# EasyEDA Pro project 4Layer_Artix7_DDR3_Core_Board.epro, board PCB1_1
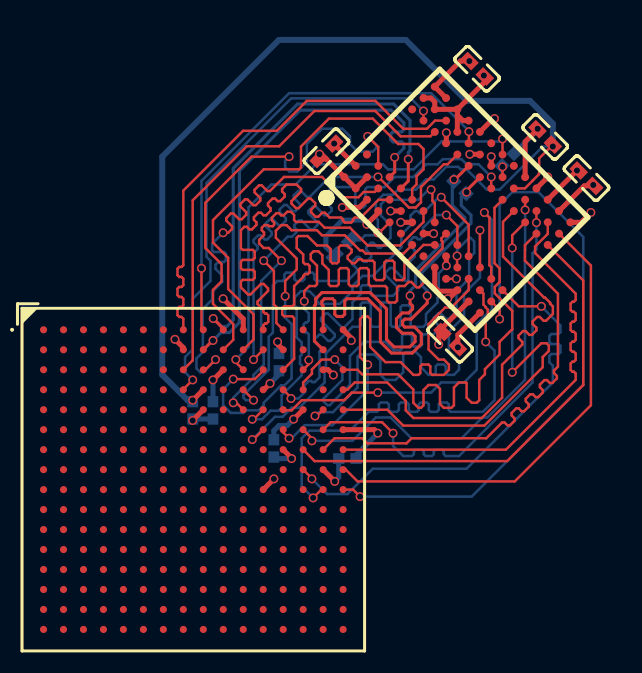
[diagram p4: board, top side]
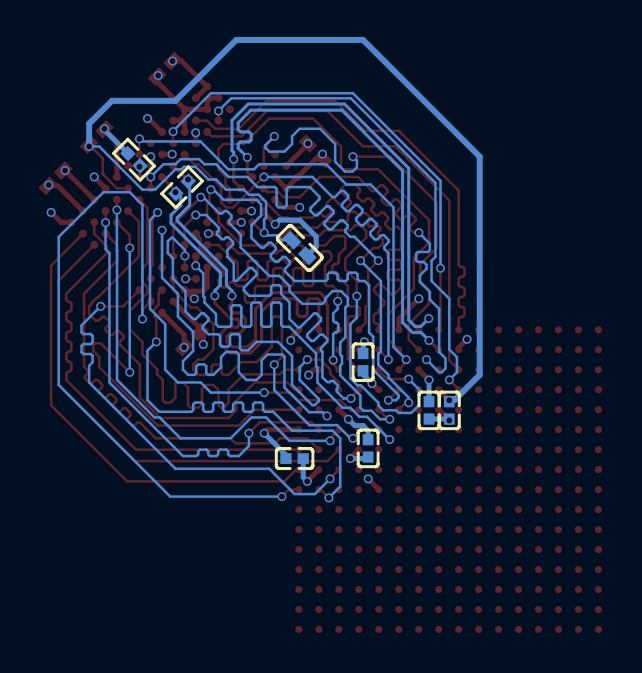
[diagram p5: board, bottom side, seen from below]

No outline. copper layers: Top Layer, Inner1, Inner2, Bottom Layer. Coordinates in mm from the lowest, leftmost part position.
Stack: Top Layer 0.035mm 外层铜厚1oz / Dielectric1 0.2104mm 7628 RC49% 8.6mil / Inner1 0.0152mm 内层铜厚 / Dielectric2 1.065mm 1.1mm H/HOZ Copper / Inner2 0.0152mm 内层铜厚 / Dielectric3 0.2104mm 7628 RC49% 8.6mil / Bottom Layer 0.035mm 外层铜厚1oz

## Design rules (mm)
net DDR_DQ2: DDR_DQ
net DDR_DQ0: DDR_DQ
net DDR_DM: DDR_DQ
net DDR_DQ3: DDR_DQ
net DDR_DQS_P: DDR_DQ, DP1
net DDR_DQ1: DDR_DQ
net DDR_DQS_N: DDR_DQ, DP1
net DDR_DQ4: DDR_DQ
net DDR_DQ5: DDR_DQ
net DDR_DQ7: DDR_DQ
net DDR_DQ6: DDR_DQ
net DDR_A8: DDR_CA
net DDR_A14: DDR_CA
net DDR_A13: DDR_CA
net DDR_A6: DDR_CA
net DDR_A11: DDR_CA
net DDR_A9: DDR_CA
net DDR_A7: DDR_CA
net DDR_A4: DDR_CA
net DDR_A1: DDR_CA
net DDR_A2: DDR_CA
net DDR_A5: DDR_CA
net DDR_BA1: DDR_CA
net DDR_A12: DDR_CA
net DDR_A0: DDR_CA
net DDR_A3: DDR_CA
net DDR_A15: DDR_CA
net DDR_BA2: DDR_CA
net DDR_BA0: DDR_CA
net DDR_A10: DDR_CA
net DDR_WE_N: DDR_CA
net DDR_CS_N: DDR_CA
net DDR_CKE: DDR_CA
net DDR_CK_N: DDR_CA, DP2
net DDR_CAS_N: DDR_CA
net DDR_ODT: DDR_CA
net DDR_CK_P: DDR_CA, DP2
net DDR_RAS_N: DDR_CA
template: 自定义配置
spacing copperThickness1oz (default): track to track 0.127, other pairs 0.127 to 0.3
spacing copperThickness2oz: track to track 0.203, other pairs 0.152 to 0.3
spacing copperThicknessInner0.5oz: track to track 0.089, other pairs 0.152 to 0.3
track width copperThickness1oz (default): min 0.102, default 0.127, max 2.54
track width copperThickness2oz: min 0.203, default 0.254, max 2.54
track width copperThickness0.5oz: min 0.089, default 0.254, max 2.54
differential pair differentialPair (default): width min 0.127, default 0.156, max 2.54; gap min 0.152, default 0.152
via viaSize (default): diameter min 0.3, default 0.45, max 10; hole min 0.2, default 0.305, max 6.3

## Placement (name value [footprint] x y rotation side)
C1  100nF  [C0402]  12.89 7.01 135 top
C3  100nF  [C0402]  14.24 20.57 135 top
C4  100nF  [C0402]  6.7 16.44 45 top
C5  100nF  [C0402]  19.72 15.09 315 top
C7  100nF  [C0402]  17.65 17.15 315 top
C8  100nF  [C0402]  7.49 11.59 45 bottom
C9  470nF  [C0402-S]  7.75 1.05 180 bottom
C10  470nF  [C0402-S]  4.06 1.56 90 bottom
C11  470nF  [C0402-S]  0 3.47 90 bottom
C12  470nF  [C0402-S]  4.32 5.88 90 bottom
C13  470nF  [C0402-S]  1.02 3.47 90 bottom
R1  240  [R0402]  15.79 16.02 225 bottom
R2  100  [R0402]  13.38 14.63 315 bottom
U1  XC7A35T-2FTG256I  [FTBGA-256_L17.0-W17.0-R16-C16-P1.00-TL]  0.03 0 0 top
U2  MT41K512M8DA-107 AIT:P  [FBGA-78_L10.5-W8.0-R13-C6-P0.80-TL]  13.25 14.01 45 top

## Footprints (pads in the part's own frame, mm; a bottom-side part is the same pattern mirrored in y, then rotated)
C0402
  rect 0.79x0.54 smd: 1(-0.545,0) 2(0.545,0)
C0402-S
  rect 0.566x0.54 smd: 1(-0.433,0) 2(0.433,0)
FBGA-78_L10.5-W8.0-R13-C6-P0.80-TL
  round 0.4 smd: A1(-3.2,4.8) A2(-2.4,4.8) A3(-1.6,4.8) A7(1.6,4.8) A8(2.4,4.8) A9(3.2,4.8) B1(-3.2,4) B2(-2.4,4) B3(-1.6,4) B7(1.6,4) B8(2.4,4) B9(3.2,4) C1(-3.2,3.2) C2(-2.4,3.2) C3(-1.6,3.2) C7(1.6,3.2) C8(2.4,3.2) C9(3.2,3.2) D1(-3.2,2.4) D2(-2.4,2.4) D3(-1.6,2.4) D7(1.6,2.4) D8(2.4,2.4) D9(3.2,2.4) E1(-3.2,1.6) E2(-2.4,1.6) E3(-1.6,1.6) E7(1.6,1.6) E8(2.4,1.6) E9(3.2,1.6) F1(-3.2,0.8) F2(-2.4,0.8) F3(-1.6,0.8) F7(1.6,0.8) F8(2.4,0.8) F9(3.2,0.8) G1(-3.2,0) G2(-2.4,0) G3(-1.6,0) G7(1.6,0) G8(2.4,0) G9(3.2,0) H1(-3.2,-0.8) H2(-2.4,-0.8) H3(-1.6,-0.8) H7(1.6,-0.8) H8(2.4,-0.8) H9(3.2,-0.8) J1(-3.2,-1.6) J2(-2.4,-1.6) J3(-1.6,-1.6) J7(1.6,-1.6) J8(2.4,-1.6) J9(3.2,-1.6) K1(-3.2,-2.4) K2(-2.4,-2.4) K3(-1.6,-2.4) K7(1.6,-2.4) K8(2.4,-2.4) K9(3.2,-2.4) L1(-3.2,-3.2) L2(-2.4,-3.2) L3(-1.6,-3.2) L7(1.6,-3.2) L8(2.4,-3.2) L9(3.2,-3.2) M1(-3.2,-4) M2(-2.4,-4) M3(-1.6,-4) M7(1.6,-4) M8(2.4,-4) M9(3.2,-4) N1(-3.2,-4.8) N2(-2.4,-4.8) N3(-1.6,-4.8) N7(1.6,-4.8) N8(2.4,-4.8) N9(3.2,-4.8)
FTBGA-256_L17.0-W17.0-R16-C16-P1.00-TL
  round 0.36 smd: A1(-7.5,7.5) A2(-6.5,7.5) A3(-5.5,7.5) A4(-4.5,7.5) A5(-3.5,7.5) A6(-2.5,7.5) A7(-1.5,7.5) A8(-0.5,7.5) A9(0.5,7.5) A10(1.5,7.5) A11(2.5,7.5) A12(3.5,7.5) A13(4.5,7.5) A14(5.5,7.5) A15(6.5,7.5) A16(7.5,7.5) B1(-7.5,6.5) B2(-6.5,6.5) B3(-5.5,6.5) B4(-4.5,6.5) B5(-3.5,6.5) B6(-2.5,6.5) B7(-1.5,6.5) B8(-0.5,6.5) B9(0.5,6.5) B10(1.5,6.5) B11(2.5,6.5) B12(3.5,6.5) B13(4.5,6.5) B14(5.5,6.5) B15(6.5,6.5) B16(7.5,6.5) C1(-7.5,5.5) C2(-6.5,5.5) C3(-5.5,5.5) C4(-4.5,5.5) C5(-3.5,5.5) C6(-2.5,5.5) C7(-1.5,5.5) C8(-0.5,5.5) C9(0.5,5.5) C10(1.5,5.5) C11(2.5,5.5) C12(3.5,5.5) C13(4.5,5.5) C14(5.5,5.5) C15(6.5,5.5) C16(7.5,5.5) D1(-7.5,4.5) D2(-6.5,4.5) D3(-5.5,4.5) D4(-4.5,4.5) D5(-3.5,4.5) D6(-2.5,4.5) D7(-1.5,4.5) D8(-0.5,4.5) D9(0.5,4.5) D10(1.5,4.5) D11(2.5,4.5) D12(3.5,4.5) D13(4.5,4.5) D14(5.5,4.5) D15(6.5,4.5) D16(7.5,4.5) E1(-7.5,3.5) E2(-6.5,3.5) E3(-5.5,3.5) E4(-4.5,3.5) E5(-3.5,3.5) E6(-2.5,3.5) E7(-1.5,3.5) E8(-0.5,3.5) E9(0.5,3.5) E10(1.5,3.5) E11(2.5,3.5) E12(3.5,3.5) E13(4.5,3.5) E14(5.5,3.5) E15(6.5,3.5) E16(7.5,3.5) F1(-7.5,2.5) F2(-6.5,2.5) F3(-5.5,2.5) F4(-4.5,2.5) F5(-3.5,2.5) F6(-2.5,2.5) F7(-1.5,2.5) F8(-0.5,2.5) F9(0.5,2.5) F10(1.5,2.5) F11(2.5,2.5) F12(3.5,2.5) F13(4.5,2.5) F14(5.5,2.5) F15(6.5,2.5) F16(7.5,2.5) G1(-7.5,1.5) G2(-6.5,1.5) G3(-5.5,1.5) G4(-4.5,1.5) G5(-3.5,1.5) G6(-2.5,1.5) G7(-1.5,1.5) G8(-0.5,1.5) G9(0.5,1.5) G10(1.5,1.5) G11(2.5,1.5) G12(3.5,1.5) G13(4.5,1.5) G14(5.5,1.5) G15(6.5,1.5) G16(7.5,1.5) H1(-7.5,0.5) H2(-6.5,0.5) H3(-5.5,0.5) H4(-4.5,0.5) H5(-3.5,0.5) H6(-2.5,0.5) H7(-1.5,0.5) H8(-0.5,0.5) H9(0.5,0.5) H10(1.5,0.5) H11(2.5,0.5) H12(3.5,0.5) H13(4.5,0.5) H14(5.5,0.5) H15(6.5,0.5) H16(7.5,0.5) J1(-7.5,-0.5) J2(-6.5,-0.5) J3(-5.5,-0.5) J4(-4.5,-0.5) J5(-3.5,-0.5) J6(-2.5,-0.5) J7(-1.5,-0.5) J8(-0.5,-0.5) J9(0.5,-0.5) J10(1.5,-0.5) J11(2.5,-0.5) J12(3.5,-0.5) J13(4.5,-0.5) J14(5.5,-0.5) J15(6.5,-0.5) J16(7.5,-0.5) K1(-7.5,-1.5) K2(-6.5,-1.5) K3(-5.5,-1.5) K4(-4.5,-1.5) K5(-3.5,-1.5) K6(-2.5,-1.5) K7(-1.5,-1.5) K8(-0.5,-1.5) K9(0.5,-1.5) K10(1.5,-1.5) K11(2.5,-1.5) K12(3.5,-1.5) K13(4.5,-1.5) K14(5.5,-1.5) K15(6.5,-1.5) K16(7.5,-1.5) L1(-7.5,-2.5) L2(-6.5,-2.5) L3(-5.5,-2.5) L4(-4.5,-2.5) L5(-3.5,-2.5) L6(-2.5,-2.5) L7(-1.5,-2.5) L8(-0.5,-2.5) L9(0.5,-2.5) L10(1.5,-2.5) L11(2.5,-2.5) L12(3.5,-2.5) L13(4.5,-2.5) L14(5.5,-2.5) L15(6.5,-2.5) L16(7.5,-2.5) M1(-7.5,-3.5) M2(-6.5,-3.5) M3(-5.5,-3.5) M4(-4.5,-3.5) M5(-3.5,-3.5) M6(-2.5,-3.5) M7(-1.5,-3.5) M8(-0.5,-3.5) M9(0.5,-3.5) M10(1.5,-3.5) M11(2.5,-3.5) M12(3.5,-3.5) M13(4.5,-3.5) M14(5.5,-3.5) M15(6.5,-3.5) M16(7.5,-3.5) N1(-7.5,-4.5) N2(-6.5,-4.5) N3(-5.5,-4.5) N4(-4.5,-4.5) N5(-3.5,-4.5) N6(-2.5,-4.5) N7(-1.5,-4.5) N8(-0.5,-4.5) N9(0.5,-4.5) N10(1.5,-4.5) N11(2.5,-4.5) N12(3.5,-4.5) N13(4.5,-4.5) N14(5.5,-4.5) N15(6.5,-4.5) N16(7.5,-4.5) P1(-7.5,-5.5) P2(-6.5,-5.5) P3(-5.5,-5.5) P4(-4.5,-5.5) P5(-3.5,-5.5) P6(-2.5,-5.5) P7(-1.5,-5.5) P8(-0.5,-5.5) P9(0.5,-5.5) P10(1.5,-5.5) P11(2.5,-5.5) P12(3.5,-5.5) P13(4.5,-5.5) P14(5.5,-5.5) P15(6.5,-5.5) P16(7.5,-5.5) R1(-7.5,-6.5) R2(-6.5,-6.5) R3(-5.5,-6.5) R4(-4.5,-6.5) R5(-3.5,-6.5) R6(-2.5,-6.5) R7(-1.5,-6.5) R8(-0.5,-6.5) R9(0.5,-6.5) R10(1.5,-6.5) R11(2.5,-6.5) R12(3.5,-6.5) R13(4.5,-6.5) R14(5.5,-6.5) R15(6.5,-6.5) R16(7.5,-6.5) T1(-7.5,-7.5) T2(-6.5,-7.5) T3(-5.5,-7.5) T4(-4.5,-7.5) T5(-3.5,-7.5) T6(-2.5,-7.5) T7(-1.5,-7.5) T8(-0.5,-7.5) T9(0.5,-7.5) T10(1.5,-7.5) T11(2.5,-7.5) T12(3.5,-7.5) T13(4.5,-7.5) T14(5.5,-7.5) T15(6.5,-7.5) T16(7.5,-7.5)
R0402
  rect 0.566x0.54 smd: 1(-0.433,0) 2(0.433,0)

## Nets
As in the schematic.

Pads without a net: U1 A2 A3 A4 A5 A6 A7 A14 B1 B2 B3 B4 B5 B6 B7 B14 B16 C1 C2 C3 C4 C6 C7 D1 D3 D4 D5 D6 D7 D10 D15 E1 E2 E3 E4 E5 E6 E7 E8 E10 F1 F2 F3 F4 F5 F7 F8 F9 F11 G1 G2 G4 G5 G6 G7 G8 G10 G11 G12 H1 H2 H3 H4 H5 H7 H8 H9 H10 H11 H12 H13 J1 J2 J3 J4 J5 J6 J7 J8 J10 J13 J14 K1 K2 K3 K5 K7 K8 K9 K10 K11 K12 K13 K15 K16 L2 L3 L4 L5 L6 L7 L8 L9 L10 L12 L13 L14 L15 L16 M1 M2 M3 M4 M5 M6 M7 M9 M10 M11 M12 M13 M14 M15 M16 N1 N2 N3 N4 N6 N7 N8 N9 N10 N11 N12 N13 N14 N16 P1 P3 P4 P5 P6 P7 P8 P9 P10 P11 P13 P14 P15 P16 R1 R2 R3 R4 R5 R6 R7 R8 R10 R11 R12 R13 R14 R15 R16 T1 T2 T3 T4 T5 T7 T8 T9 T10 T11 T12 T13 T14 T15; U2 A3 A7 F1 F9 H1 H9

## Via types
v1: diameter 0.45, hole 0.305, Top Layer to Bottom Layer, 95 vias

## Routing (per net, layer and track width the routed paths; a pad name or vN(x,y) marks a point on that pad's centre or on a via; arc(x,y) is an arc through that point)
+1V5: length 24.5
  Top Layer w0.127: U2.K1 v1(13.21,10.05)
  Top Layer w0.254: U1.C10 1.02,4.99 v1(1.02,4.99) ; U1.J12 4.06,0.03 v1(4.06,0.04) ; v1(13.85,20.95) 13.41,20.95 12.12,19.67 12.69,19.1 ; U1.B13 4.25,6.78 v1(4.25,6.9) ; 12.51,7.61 13.82,8.92 ; 12.51,7.61 12.51,7.39 ; 12.51,7.61 12.32,7.42 v1(12.32,6.77) ; U2.G8 v1(14.95,16.17) ; U2.E2 v1(9.91,13.45) ; v1(12.7,17.36) 12.7,16.85 U2.D7 ; v1(7.08,16.82) 7.08,16.79 U2.A2 ; v1(15.11,18.07) 15.05,18.07 U2.E9 ; U1.E14 5.06,3.02 v1(5.05,3.02) ; v1(7.94,6.96) 7.94,7.09 U1.A16 ; U2.K9 17.78,15.14 v1(17.78,15.15) ; U1.H15 7.11,-0.08 v1(7.11,-0.09) ; U2.G2 v1(12.06,12.31) ; U2.M9 19.6,14.7 C5.2 ; v1(7.49,13.63) 8.34,13.63 U2.C1
  Bottom Layer w0.254: v1(7.11,-0.09) 7.31,0.11 C9.2 ; 4.3,6.25 4.3,6.78 4.23,6.85 ; C10.2 4.06,2.45 4.32,2.7 4.73,2.7 v1(5.05,3.02) ; v1(1.02,4.99) C13.2
  vias: v1(20.06,14.75)
GND: length 39.7
  Top Layer w0.254: U1.C15 6.78,5.5 v1(7.04,5.24) ; C3.1 14.63,19.91 U2.C9 ; 13.25,18.25 U2.D8 ; 13.25,18.25 13.53,17.97 U2.D9 ; 13.25,18.25 U2.C9 ; U1.A11 2.53,8.05 v1(1.52,9.06) ; U1.D12 3.56,4.5 v1(3.87,4.81) ; U1.G13 4.95,1.08 v1(4.95,1.05) ; 13.2,9.44 12.82,9.06 v1(12.77,9.06) ; 13.2,9.44 12.32,9.44 12.12,9.63 U2.J1 ; 13.2,9.44 U2.L1 ; U1.B8 -0.47,6.6 v1(-0.89,7.02) ; U2.N1 13.28,7.25 v1(13.28,6.62) ; v1(19.94,13.37) 19.45,12.88 18.91,12.88 ; U2.F8 14.37,16.29 v1(13.88,16.29) ; v1(0,2.96) 0,2.97 U1.E9 ; U2.C9 U2.B8 12.12,18.9 11.92,19.1 U2.A8 ; 9.29,13.45 9.29,13.36 v1(8.72,12.78) ; U2.L9 v1(19.24,15.47) 19.33,15.47 ; v1(9.27,2.32) 9.09,2.5 U1.F16 ; 6.69,16.05 6.44,16.29 v1(6.35,16.29) ; 6.69,16.05 C4.1 ; 6.69,16.05 U2.A1 U2.B1 U2.B2 ; C7.1 16.65,16.92 U2.J9 ; 10.99,12.88 v1(10.41,12.88)
  Bottom Layer w0.254: v1(8.72,12.78) 8.51,12.99 7.49,12.99 6.67,12.17 6.67,11.65 C8.1 ; R1.1 17.27,17.5 v1(17.27,17.56) ; C13.1 0.07,3.03 v1(0,2.96) ; v1(4.95,1.05) 4.14,1.05 C10.1 ; C12.1 4.32,5.26 v1(3.87,4.81) ; v1(9.27,2.32) 8.18,1.23 C9.1
  vias: v1(14.58,20.23)
DDR_A0: length 23.2
  Top Layer w0.127: v1(12.45,14.14) 13.82,12.76 U2.K3 ; U1.E12 3.06,3.02 v1(2.98,3.02)
  Bottom Layer w0.127: 5.08,9.1 5.08,8.73 5.21,8.61 5.21,7.12 5.46,6.87 5.46,6.25 5.37,6.17 5.37,5.8 5.46,5.71 5.46,5.22 4.45,4.21 4.45,3.6 4.3,3.45 3.9,3.45 3.47,3.02 v1(2.98,3.02) ; 5.08,9.1 5.07,9.08 ; 5.08,9.1 5.42,9.44 5.84,9.44 6.22,9.06 6.22,8.93 6.35,8.8 7.37,8.8 8,9.44 8,9.69 8.51,10.2 9.02,10.2 10.45,11.63 10.45,12.26 11.03,12.84 11.03,12.97 10.91,13.09 10.91,13.22 11.13,13.44 11.26,13.44 11.38,13.32 11.51,13.32 12.32,14.14 v1(12.45,14.14)
DDR_A1: length 23
  Top Layer w0.127: U1.E16 9.75,3.5 10.54,2.7 14.6,2.7 17.53,5.63 17.53,6.13 17.83,6.44 17.83,6.72 17.73,6.82 17.45,6.82 v1(16,5.37) ; v1(16,11.59) 16,12.23 16.65,12.88
  Bottom Layer w0.127: v1(16,11.59) v1(16,5.37)
DDR_A2: length 23.4
  Top Layer w0.127: U2.L3 v1(14.38,12.48) ; U1.E15 6.22,3.19 v1(6.12,3.19)
  Bottom Layer w0.127: v1(6.12,3.19) 6.31,3.37 7.02,3.37 8.25,4.61 8.25,6.16 8.36,6.26 9.11,6.26 9.4,5.97 9.4,5.25 9.65,4.99 10.16,4.99 10.54,5.37 10.54,6.26 10.67,6.39 11.18,6.39 11.43,6.13 11.43,5.63 11.81,5.25 12.08,5.25 12.17,5.33 12.17,5.67 12.26,5.76 12.58,5.76 12.67,5.67 12.67,5.33 12.76,5.25 13.08,5.25 13.34,5.5 13.34,5.93 12.83,6.44 12.83,7.4 13.59,8.17 13.59,9.31 14.38,10.1 v1(14.38,12.48)
DDR_A3: length 23.4
  Top Layer w0.127: U2.K2 13.24,10.63 v1(13.24,11.2) ; v1(7.11,6.01) 6.46,6.01 5.97,5.52 5.97,5.3 5.97,5.3 5.53,4.86 U1.D14
  Bottom Layer w0.127: v1(7.11,6.01) 7.49,5.63 7.49,4.99 6.54,4.04 6.54,3.93 6.74,3.73 6.87,3.73 7.87,4.74 7.87,6.19 8.58,6.9 9.65,6.9 10.07,6.47 10.39,6.47 10.48,6.56 10.48,7.19 10.57,7.28 10.89,7.28 10.98,7.19 10.98,6.75 11.07,6.66 11.39,6.66 11.48,6.75 11.48,7.19 11.57,7.28 12.06,7.28 12.34,7.56 12.34,7.68 12.06,7.97 12.06,8.09 12.29,8.32 12.42,8.32 12.7,8.04 12.83,8.04 13.21,8.42 13.21,9.44 13.38,9.61 13.39,9.61 13.65,9.87 13.65,9.88 13.84,10.07 13.84,11.09 14.1,11.34 14.1,11.92 13.92,12.1 13.84,12.1 13.24,11.5 v1(13.24,11.2)
DDR_A4: length 22.8
  Top Layer w0.127: v1(10.03,2.32) 9.49,2.87 6.9,2.87 U1.F15 ; U2.L8 v1(17.21,12.86)
  Bottom Layer w0.127: v1(17.21,12.86) 17.21,11.54 17.02,11.34 17.02,4.86 13.34,1.18 12.66,1.18 12.57,1.27 12.57,1.41 12.48,1.5 12.16,1.5 12.07,1.41 12.07,1.27 11.98,1.18 11.66,1.18 11.57,1.27 11.57,1.41 11.48,1.5 11.16,1.5 11.07,1.41 11.07,1.27 10.98,1.18 10.54,1.18 10.03,1.69 v1(10.03,2.32)
DDR_A5: length 22.8
  Top Layer w0.127: U1.F13 4.53,2.36 v1(4.83,2.07) ; v1(8.76,5.75) 8.38,6.13 8.38,8.04 8.51,8.17 8.76,8.17 8.89,8.04 8.89,6.64 9.65,5.88 10.41,5.88 11.05,5.25 11.31,5.25 11.4,5.33 11.4,5.67 11.49,5.76 11.81,5.76 11.9,5.67 11.9,5.33 11.99,5.25 12.58,5.25 12.83,5.49 12.83,5.76 12.58,6.01 12.32,6.01 11.81,6.52 11.81,7.78 12.64,8.61 12.95,8.61 13.82,9.48 U2.L2
  Bottom Layer w0.127: v1(8.76,5.75) 8.76,4.48 7.01,2.73 5.61,2.73 4.95,2.07 v1(4.83,2.07)
DDR_A6: length 23.3
  Top Layer w0.127: 17.78,12.88 17.78,12.3 17.14,11.67 17.14,11.34 19.18,9.31 19.18,8.99 19.09,8.9 19.01,8.9 18.92,8.81 18.92,8.49 19.01,8.4 19.09,8.4 19.18,8.31 19.18,7.99 19.09,7.9 19.01,7.9 18.92,7.81 18.92,7.49 19.01,7.4 19.09,7.4 19.18,7.31 19.18,6.99 19.09,6.9 19.01,6.9 18.92,6.81 18.92,6.49 19.01,6.4 19.09,6.4 19.18,6.31 19.18,5.99 19.09,5.9 19.01,5.9 18.92,5.81 18.92,5.49 19.01,5.4 19.09,5.4 19.18,5.31 19.18,4.99 15.69,1.5 U1.G16
DDR_A7: length 23.1
  Top Layer w0.127: v1(14.67,6.9) 14.67,8.09 14.77,8.19 14.77,8.52 14.67,8.62 14.67,8.64 14.56,8.76 14.56,9.31 U2.M2 ; v1(6.03,-0.91) 6.45,-0.5 U1.J15
  Bottom Layer w0.127: v1(6.03,-0.91) 5.46,-0.34 5.46,2.07 5.84,2.45 7.87,2.45 8.82,3.39 9.23,3.39 9.32,3.48 9.32,3.77 9.41,3.86 9.73,3.86 9.82,3.77 9.82,3.48 9.91,3.39 10.23,3.39 10.32,3.48 10.32,3.77 10.41,3.86 10.73,3.86 10.82,3.77 10.82,3.48 10.91,3.39 11.23,3.39 11.32,3.48 11.32,3.77 11.41,3.86 11.73,3.86 11.82,3.77 11.82,3.48 11.91,3.39 12.23,3.39 12.32,3.48 12.32,3.77 12.41,3.86 12.73,3.86 12.82,3.77 12.82,3.48 12.91,3.39 14.53,3.39 15.11,3.97 15.11,6.46 v1(14.67,6.9)
DDR_A8: length 23.5
  Top Layer w0.127: U2.N8 19.94,10.72 19.94,3.72 16.13,-0.09 8.25,-0.09 7.67,0.5 U1.H16
DDR_A9: length 22.4
  Top Layer w0.127: v1(9.27,4.36) 7.96,4.36 7.58,3.97 5.46,3.97 4.95,3.47 4.56,3.47 U1.E13 ; U2.M3 14.95,10.64 14.86,10.73 14.86,13.12 v1(14.6,13.37)
  Bottom Layer w0.127: v1(14.6,13.37) 14.99,12.99 14.99,8.55 14.22,7.78 14.22,5.5 13.59,4.86 12.45,4.86 11.94,4.36 v1(9.27,4.36)
DDR_A10: length 23.3
  Top Layer w0.127: U1.A13 4.19,7.84 4.19,8.64 4.06,8.77 4.06,10.45 v1(3.56,10.96) ; U2.H7 v1(14.95,15.15)
  Bottom Layer w0.127: v1(14.95,15.15) 14.31,15.79 13.72,15.79 13.46,16.04 12.52,16.04 12.27,15.79 11.68,15.79 11.05,15.15 10.11,15.15 9.61,14.64 8.74,14.64 8.65,14.55 8.65,13.72 8.56,13.63 8.24,13.63 8.15,13.72 8.15,14.55 8.06,14.64 6.98,14.64 6.51,14.16 6.51,14.04 6.96,13.59 6.96,13.46 6.73,13.23 6.61,13.23 6.15,13.68 6.03,13.68 5.8,13.46 5.8,13.33 6.25,12.88 6.25,12.75 6.03,12.53 5.9,12.53 5.45,12.98 5.32,12.98 5.09,12.75 5.09,12.62 5.2,12.52 5.2,12.39 4.97,12.16 4.76,12.16 v1(3.56,10.96)
DDR_A11: length 23.5
  Top Layer w0.127: U1.G15 7.1,2.07 8.49,2.07 8.74,1.82 10.71,1.82 10.96,2.07 14.7,2.07 15.49,2.86 15.62,2.86 15.76,2.72 15.89,2.72 16.11,2.94 16.11,3.07 15.97,3.21 15.97,3.34 16.2,3.57 16.32,3.57 16.47,3.42 16.59,3.42 16.82,3.65 16.82,3.78 16.68,3.92 16.68,4.05 16.9,4.27 17.03,4.27 17.17,4.13 17.3,4.13 17.53,4.36 17.53,4.48 17.38,4.63 17.38,4.75 17.61,4.98 17.74,4.98 17.88,4.84 18.01,4.84 18.24,5.06 18.24,5.19 18.09,5.33 18.09,5.46 18.29,5.66 18.29,9.31 16.64,10.96 16.64,11.74 U2.M7
DDR_A12: length 22.6
  Top Layer w0.127: 16.08,13.45 15.54,12.9 15.54,11.17 17.59,9.11 17.64,9.11 17.9,8.86 17.9,8.81 18.03,8.67 18.03,8.29 17.69,7.95 17.57,7.95 17.38,8.14 17.25,8.14 17.02,7.92 17.02,7.79 17.21,7.6 17.21,7.47 16.99,7.25 16.86,7.25 16.67,7.44 16.54,7.44 16.32,7.21 16.32,7.08 16.51,6.89 16.51,6.77 15.49,5.75 15.49,4.1 14.48,3.09 11.05,3.09 10.67,3.47 10.67,3.94 9.74,4.86 8.11,4.86 7.75,4.5 U1.D16
DDR_A13: length 23.2
  Top Layer w0.127: v1(5.97,0.04) 5.97,0.06 U1.H14 ; v1(17.46,8.67) 16.33,8.67 U2.N3
  Bottom Layer w0.127: v1(5.97,0.04) 6.73,-0.72 7.75,-0.72 9.02,0.55 13.72,0.55 18.03,4.86 18.03,5.7 17.86,5.88 17.86,6.2 17.95,6.29 18.32,6.29 18.41,6.38 18.41,6.7 18.32,6.79 17.95,6.79 17.86,6.88 17.86,7.2 17.95,7.29 18.32,7.29 18.41,7.38 18.41,7.72 v1(17.46,8.67)
DDR_A14: length 23.6
  Top Layer w0.127: U1.G14 6.1,0.93 15.75,0.93 19.56,4.74 19.56,9.97 U2.N7
DDR_A15: length 23.2
  Top Layer w0.127: 8.25,5.5 U1.C16 ; 8.25,5.5 8.48,5.27 10.29,5.27 11.05,4.51 11.05,3.85 11.3,3.59 11.43,3.59 11.56,3.72 11.56,4.48 11.81,4.74 12.19,4.74 12.38,4.55 12.38,3.78 12.57,3.59 12.95,3.59 13.08,3.72 13.08,4.61 13.34,4.86 13.68,4.86 13.72,4.83 13.72,4.1 13.97,3.85 14.22,3.85 14.35,3.97 14.35,4.99 14.63,5.27 14.63,5.53 15.37,6.26 15.37,6.9 16,7.53 16,8.45 15.12,9.32 15.12,9.65 15.37,9.89 15.37,10.58 15.11,10.83 15.11,13.61 U2.J7
DDR_BA0: length 22.9
  Top Layer w0.127: v1(2.98,2.01) 3.04,2.01 U1.F12
  Top Layer w0.254: U2.J2 12.7,11.17 v1(12.7,10.71)
  Bottom Layer w0.127: v1(12.7,10.71) 12.32,10.33 12.32,9.17 12.26,9.11 12.26,8.87 11.68,8.29 11.68,7.78 11.55,7.65 11,7.65 10.91,7.74 10.91,8.63 10.82,8.72 10.5,8.72 10.41,8.63 10.41,7.74 10.32,7.65 10,7.65 9.91,7.74 9.91,8.78 9.82,8.87 9.5,8.87 9.41,8.78 9.41,7.74 9.32,7.65 9,7.65 8.91,7.74 8.91,8.78 8.82,8.87 8.5,8.87 8.41,8.78 8.41,7.74 8.32,7.65 8,7.65 6.67,6.32 6.67,5.68 6.6,5.61 6.6,4.86 5.33,3.59 4.95,3.59 4.5,3.14 4.12,3.14 v1(2.98,2.01)
DDR_BA1: length 22.6
  Top Layer w0.127: v1(5.97,1.94) 5.97,2.06 U1.F14 ; U2.K8 v1(16.65,13.5)
  Bottom Layer w0.127: v1(5.97,1.94) 8,1.94 9.17,3.11 9.91,3.11 10.95,2.07 13.46,2.07 14.5,3.11 14.76,3.11 16.64,4.99 16.64,11.47 16.65,11.48 v1(16.65,13.5)
DDR_BA2: length 23.1
  Top Layer w0.127: v1(4.92,4.06) 4.92,4.11 U1.D13 ; v1(12.7,13.25) 13.25,12.69 U2.J3
  Bottom Layer w0.127: v1(12.7,13.25) 12.17,13.25 11.53,12.61 11.53,12.48 11.62,12.39 11.62,12.26 11.4,12.04 11.27,12.04 11.18,12.13 11.05,12.13 10.83,11.9 10.83,11.77 11.11,11.49 11.11,11.15 10.79,10.83 10.79,9.97 10.77,9.95 10.65,9.95 10.01,10.59 9.88,10.59 9.65,10.36 9.65,10.24 10.29,9.6 10.29,9.47 10.02,9.2 9.01,9.2 8.92,9.29 8.92,9.64 8.83,9.73 8.51,9.73 8.42,9.64 8.42,9.29 8,8.87 8,8.04 7.59,7.63 7.46,7.63 6.78,8.31 6.65,8.31 6.43,8.09 6.43,7.96 7.11,7.28 7.11,7.15 6.91,6.95 6.78,6.95 6.47,7.26 6.34,7.26 6.11,7.03 6.11,6.91 6.43,6.59 6.43,6.47 6.36,6.4 6.35,6.4 6.35,6.41 6.35,5.12 6.11,4.88 5.99,4.88 5.94,4.94 5.81,4.94 5.58,4.71 5.58,4.58 5.63,4.53 5.63,4.4 5.29,4.06 v1(4.92,4.06)
DDR_CAS_N: length 23.7
  Top Layer w0.127: v1(11.94,14.52) 12.01,14.45 12.01,13.95 12.12,13.84 12.12,12.88 ; v1(3.05,3.97) 3.05,3.98 U1.D11
  Bottom Layer w0.127: v1(3.05,3.97) 2.67,3.97 2.54,4.1 2.54,4.23 3.81,5.5 3.81,7.16 4.02,7.36 4.02,9.72 4.24,9.94 4.5,9.94 4.59,10.03 4.59,10.27 4.68,10.36 5,10.36 5.09,10.27 5.09,10.03 5.18,9.94 5.5,9.94 5.59,10.03 5.59,10.27 5.68,10.36 6,10.36 6.09,10.27 6.09,10.03 6.18,9.94 7.75,9.94 8.23,10.42 8.23,10.55 7.99,10.79 7.99,10.92 8.21,11.15 8.34,11.15 8.58,10.91 8.71,10.91 8.94,11.13 8.94,11.26 8.69,11.5 8.69,11.63 8.92,11.85 9.05,11.85 9.29,11.61 9.42,11.61 9.91,12.1 9.91,12.74 9.43,13.22 9.43,13.78 9.65,14.01 11.3,14.01 11.81,14.52 v1(11.94,14.52)
DDR_CK_N: length 21.7
  Top Layer w0.156: v1(11.74,9.2) 11.74,8.83 10.94,8.03 10.62,8.03 10.51,7.92 10.51,7.75 10.62,7.64 11.11,7.64 11.45,7.3 11.45,6.78 11,6.33 9.96,6.33 9.4,6.9 9.4,8.42 8.76,9.06 7.72,9.06 7.61,8.94 7.61,8.28 7.5,8.17 7.22,8.17 7.11,8.28 7.11,8.94 7,9.06 6.6,9.06 6.47,8.92 6.47,8.77 6.53,8.7 U1.A15 ; v1(13.72,14.39) 13.72,14.47 U2.G7
  Bottom Layer w0.156: v1(11.74,9.2) 11.74,9.46 11.47,9.73 11.47,10.36 13.93,12.83 13.93,13.24 13.45,13.72 13.45,14.15 13.76,14.45
DDR_CK_P: length 21.8
  Top Layer w0.156: v1(13.08,15.02) 13.13,15.02 U2.F7 ; v1(10.89,9.2) 10.89,8.82 11.01,8.7 11.01,8.54 10.81,8.34 10.49,8.34 10.2,8.05 10.2,7.62 10.49,7.33 10.98,7.33 11.14,7.17 11.14,6.91 10.87,6.64 10.09,6.64 9.71,7.02 9.71,8.55 8.89,9.36 6.47,9.36 6.16,9.05 6.16,8.77 6.1,8.7 6.1,6.94 U1.B15
  Bottom Layer w0.156: v1(13.08,15.02) 13,14.94 13,13.74 13.62,13.11 13.62,12.96 11.16,10.49 11.16,9.73 10.89,9.46 v1(10.89,9.2)
DDR_CKE: length 23.7
  Top Layer w0.127: v1(2.16,6.01) 2.16,5.87 U1.C11 ; U2.G9 v1(15.52,17.06)
  Bottom Layer w0.127: v1(15.52,17.06) 15.39,16.93 12.89,16.93 12.88,16.92 12.52,16.92 12.51,16.93 12.46,16.93 11.07,15.53 9.78,15.53 9.53,15.79 6.17,15.79 5.15,14.77 3.94,14.77 2.79,13.63 2.79,6.64 v1(2.16,6.01)
DDR_CS_N: length 22.1
  Top Layer w0.127: U1.C13 5.08,6.05 5.08,8.09 4.99,8.18 4.58,8.18 4.49,8.27 4.49,8.59 4.58,8.68 4.99,8.68 5.08,8.77 5.08,9.69 5.53,10.14 5.53,10.2 5.62,10.29 5.76,10.29 5.85,10.38 5.85,10.7 5.76,10.79 5.62,10.79 5.53,10.88 5.53,11.27 5.21,11.59 5.21,12.1 5.3,12.19 5.75,12.19 6.22,11.72 6.72,11.72 6.9,11.54 6.9,10.92 6.99,10.83 7.22,10.83 7.31,10.92 7.31,11.63 7.4,11.72 7.75,11.72 7.96,11.51 7.96,11.38 7.76,11.19 7.76,11.06 7.99,10.83 8.11,10.83 8.31,11.03 8.44,11.03 8.51,10.96 9.01,10.96 9.1,10.87 9.1,10.08 9.19,9.99 9.51,9.99 9.6,10.08 9.6,10.87 9.69,10.96 10.01,10.96 10.1,10.87 10.1,10.08 10.19,9.99 10.51,9.99 10.6,10.08 10.6,10.87 10.69,10.96 10.77,10.96 11.56,11.75 U2.H2
DDR_DM: length 24.7
  Top Layer w0.127: U1.D8 -0.47,4.52 v1(0,4.99) ; U2.B7 v1(11.56,18.45)
  Bottom Layer w0.127: v1(11.56,18.45) 10.92,19.09 4.93,19.09 0.69,14.85 0.69,11.15 0.89,10.96 0.89,9.94 0,9.06 0,6.52 -0.38,6.13 -0.38,5.37 v1(0,4.99)
DDR_DQ0: length 23.6
  Top Layer w0.127: v1(8.76,17.18) 9.29,16.65 9.29,15.71 ; U1.B10 2.03,7 2.03,7.78 1.02,8.8 1.02,9.5 1.45,9.93 1.45,10.78 0.63,11.59 0.63,13.86 2.94,16.17 v1(4.83,16.17)
  Bottom Layer w0.127: 5.24,15.43 5.23,15.43 ; 5.23,15.43 4.84,15.43 4.63,15.64 4.63,15.97 v1(4.83,16.17) ; 5.23,15.43 5.72,15.91 5.72,16.8 6.48,17.56 7.49,17.56 7.87,17.18 7.87,16.8 8.25,16.42 9.02,16.42 9.21,16.61 9.21,16.74 v1(8.76,17.18)
DDR_DQ1: length 23.3
  Top Layer w0.127: U1.C8 0,5.97 0,13.98 2.71,16.69 4.33,16.69 6.1,18.45 9.14,18.45 10.41,17.18 11.9,17.18 U2.C7
DDR_DQ2: length 23.2
  Top Layer w0.127: U1.C9 0.64,5.5 v1(1.14,6.01) ; v1(1.52,12.36) 1.78,12.36 1.97,12.55 1.97,12.68 1.68,12.97 1.68,13.09 1.91,13.32 2.04,13.32 2.33,13.03 2.45,13.03 2.68,13.26 2.68,13.39 2.39,13.67 2.39,13.8 2.62,14.03 2.74,14.03 3.03,13.74 3.16,13.74 3.39,13.97 3.39,14.09 3.1,14.38 3.1,14.51 3.32,14.73 3.45,14.73 3.74,14.45 3.87,14.45 4.57,15.15 6.48,15.15 7.49,14.14 8.3,14.14 8.57,14.4 9.12,14.4 9.29,14.58
  Bottom Layer w0.127: v1(1.52,12.36) 0.97,11.81 0.97,11.49 1.06,11.4 1.57,11.4 1.66,11.31 1.66,10.99 1.57,10.9 1.28,10.9 1.14,10.75 1.14,10.55 1.47,10.22 1.47,9.9 0.97,9.39 0.97,9.01 0.51,8.55 0.51,6.39 0.19,6.07 0.19,5.56 0.38,5.37 0.51,5.37 v1(1.14,6.01)
DDR_DQ3: length 23.9
  Top Layer w0.127: U1.A8 -0.47,8.06 -0.56,8.15 -0.67,8.15 -0.76,8.24 -0.76,8.56 -0.67,8.65 -0.56,8.65 -0.47,8.74 -0.47,9.06 -0.56,9.15 -0.67,9.15 -0.76,9.24 -0.76,9.56 -0.67,9.65 -0.56,9.65 -0.47,9.74 -0.47,10.06 -0.56,10.15 -0.67,10.15 -0.76,10.24 -0.76,10.56 -0.67,10.65 -0.56,10.65 -0.47,10.74 -0.47,14.47 2.52,17.46 4.22,17.46 5.72,18.96 9.14,18.96 10.54,17.56 11.73,17.56 12.13,17.97 U2.C8
DDR_DQ4: length 24.2
  Top Layer w0.127: U2.E3 10.99,14.56 11.21,14.78 11.21,15.18 11.56,15.53 11.56,16.55 11.3,16.8 10.29,16.8 9.02,18.07 6.82,18.07 5.42,16.67 5.42,15.62 5.33,15.53 3.56,15.53 1.02,12.99 1.02,11.87 1.78,11.1 1.78,9.54 3.05,8.27 3.05,7.02 U1.B11
DDR_DQ5: length 24.1
  Top Layer w0.127: U2.E8 13.83,16.85 v1(13.83,17.42) ; U1.A9 0.44,7.59 v1(0.44,10.58)
  Bottom Layer w0.127: v1(0.44,10.58) 0.44,14.96 4.83,19.34 11.94,19.34 13.83,17.45 v1(13.83,17.42)
DDR_DQ6: length 23.2
  Top Layer w0.127: U2.D2 9.31,14.01 8.41,13.12 8.12,13.12 8.03,13.03 8.03,12.95 7.94,12.86 7.62,12.86 7.53,12.95 7.53,13.03 7.44,13.12 6.86,13.12 6.62,13.36 6.49,13.36 6.28,13.16 6.16,13.16 5.93,13.38 5.93,13.51 6.13,13.72 6.13,13.84 5.91,14.07 5.78,14.07 5.3,13.59 5.17,13.59 4.95,13.81 4.95,13.94 5.43,14.42 5.43,14.55 5.21,14.77 4.7,14.77 4.48,14.55 4.48,14.42 4.61,14.29 4.61,14.17 4.38,13.94 4.25,13.94 4.12,14.07 4,14.07 3.77,13.84 3.77,13.72 3.9,13.59 3.9,13.46 3.67,13.23 3.55,13.23 3.42,13.36 3.29,13.36 3.06,13.14 3.06,13.01 3.19,12.88 3.19,12.75 2.97,12.53 2.84,12.53 2.71,12.65 2.58,12.65 2.41,12.48 2.41,11.59 2.5,11.5 3.01,11.5 3.1,11.41 3.1,11.09 3.01,11 2.5,11 2.41,10.91 2.41,10.59 2.5,10.5 3.01,10.5 3.1,10.41 3.1,10.09 3.01,10 2.5,10 2.41,9.91 2.41,9.62 2.77,9.27 2.89,9.27 3.42,9.8 3.55,9.8 3.77,9.57 3.77,9.44 3.25,8.92 3.25,8.79 3.53,8.5 3.53,8.4 3.62,8.31 3.7,8.31 3.79,8.22 3.79,7.9 3.7,7.81 3.62,7.81 3.53,7.72 U1.A12
DDR_DQ7: length 23.8
  Top Layer w0.127: U2.E7 12.76,15.79 12.57,15.79 11.43,14.64 11.43,13.88 11.18,13.63 11.16,13.63 11.15,13.62 10.83,13.62 9.3,15.15 v1(9.28,15.15) ; v1(3.05,6.01) 3.05,6.02 U1.B12
  Bottom Layer w0.127: v1(3.05,6.01) 3.05,11.34 3.25,11.55 3.25,11.67 3.05,11.87 3.05,12 3.27,12.23 3.4,12.23 3.6,12.03 3.73,12.03 3.96,12.25 3.96,12.38 3.65,12.69 3.65,12.82 3.88,13.04 4,13.04 4.31,12.73 4.44,12.73 4.66,12.96 4.66,13.09 4.36,13.4 4.36,13.52 4.58,13.75 4.71,13.75 5.02,13.44 5.14,13.44 5.37,13.67 5.37,13.79 5.06,14.1 5.06,14.23 5.29,14.46 5.42,14.46 5.72,14.15 5.85,14.15 6.86,15.15 v1(9.28,15.15)
DDR_DQS_N: length 23.8
  Top Layer w0.156: v1(10.79,16.04) 10.79,14.95 U2.D3 ; v1(1.03,8.06) 1.53,7.56 U1.A10
  Bottom Layer w0.156: v1(1.03,8.06) 1.42,7.67 1.71,7.67 2.03,7.99 2.03,15.58 5.25,18.8 10.06,18.8 10.88,17.99 10.88,16.46 10.79,16.38 v1(10.79,16.04)
DDR_DQS_P: length 23.8
  Top Layer w0.156: U2.C3 10.12,15.4 v1(10.12,16.13) ; U1.B9 1,6.97 v1(1.02,6.97)
  Bottom Layer w0.156: v1(1.02,6.97) 1.41,7.36 1.84,7.36 2.34,7.86 2.34,15.46 5.38,18.5 9.94,18.5 10.57,17.86 10.57,17.52 10.46,17.41 10.03,17.41 9.92,17.3 9.92,17.02 10.03,16.91 10.46,16.91 10.57,16.8 10.57,16.59 v1(10.12,16.13)
DDR_ODT: length 23.5
  Top Layer w0.127: 3.59,5.5 3.11,5.03 v1(2.03,5.03) ; v1(4.63,9.18) 4.63,9.94 5.21,10.52 5.21,11.07 4.16,12.11 4.16,12.46 4.44,12.74 4.7,12.74 4.95,12.48 6.22,12.48 6.48,12.23 7.62,12.23 8.38,11.47 8.51,11.47 8.66,11.32 10.56,11.32 U2.G1
  Bottom Layer w0.127: v1(2.03,5.03) 1.52,4.52 1.52,3.72 1.91,3.34 2.54,3.34 2.67,3.47 3.3,3.47 3.56,3.72 3.56,3.85 4.43,4.72 4.6,4.72 4.95,5.07 4.95,7.78 4.63,8.11 v1(4.63,9.18)
DDR_RAS_N: length 22.1
  Top Layer w0.127: v1(2.03,3.85) 2.18,3.85 U1.E11 ; v1(4.44,10.96) 3.81,11.59 3.56,11.59 3.33,11.82 3.33,12 3.57,12.25 3.57,12.37 3.46,12.48 3.46,12.61 3.59,12.74 3.77,12.74 3.83,12.68 4.01,12.68 4.07,12.75 4.07,12.88 3.97,12.99 3.97,13.11 4.19,13.34 4.32,13.34 4.43,13.23 4.56,13.23 4.74,13.41 4.92,13.41 5.08,13.25 5.08,12.99 5.17,12.9 6.31,12.9 6.6,12.61 7.87,12.61 8.76,11.72 10.38,11.72 11.56,12.89 U2.F3
  Bottom Layer w0.127: v1(4.44,10.96) 3.43,9.94 3.43,6.41 3.56,6.28 3.56,5.75 3.05,5.25 3.05,5.12 2.03,4.1 v1(2.03,3.85)
DDR_RST_N: length 34
  Top Layer w0.127: U1.J16 8.03,-0.5 v1(8.38,-0.85) ; v1(15.37,8.04) 15.37,8.5 14.95,8.92
  Bottom Layer w0.127: v1(8.38,-0.85) 13.97,-0.85 19.56,4.74 19.56,12.14 17.31,14.39 16,14.39 15.37,13.75 v1(15.37,8.04)
DDR_VREF: length 56.8
  Top Layer w0.127: U2.J8 16.63,14.58 17.04,14.98 17.04,14.98 17.34,15.29 17.34,15.33 17.35,15.35 17.35,16.08 C7.2 ; v1(9.27,12.36) 9.34,12.36 9.86,12.88
  Top Layer w0.254: U1.D9 0.01,3.97 v1(0,3.97)
  Bottom Layer w0.127: v1(18.03,16.67) 17.53,16.67 15.37,14.52 14.73,14.52 13.72,15.53 13.42,15.53 13.29,15.66 12.7,15.66 12.06,15.02 11.68,15.02 11.18,14.52 10.29,14.52 10.03,14.26 9.55,14.26 9.17,13.89 9.17,13.11 9.27,13.01 v1(9.27,12.36) 9.14,12.23 8.64,12.23 8.39,11.98 C8.2
  Bottom Layer w0.3: v1(0,3.97) -0.25,3.97 -1.52,5.25 -1.52,16.17 4.32,22.01 10.67,22.01 13.72,18.96 16.89,18.96 18.03,17.82 v1(18.03,16.67)
DDR_WE_N: length 22.2
  Top Layer w0.127: U1.C14 5.81,5.78 v1(5.81,5.98) ; 5.66,9 v1(5.59,8.93) 5.59,9.44 5.84,9.69 6.13,9.69 6.22,9.78 6.22,10.71 5.91,11.03 5.91,11.29 6.05,11.43 6.3,11.43 6.5,11.23 6.5,10.82 6.81,10.5 6.81,9.78 6.9,9.69 7.22,9.69 7.31,9.78 7.31,10.5 7.4,10.59 7.72,10.59 7.81,10.5 7.81,9.78 7.9,9.69 8.22,9.69 8.31,9.78 8.31,10.5 8.4,10.59 8.72,10.59 8.81,10.5 8.81,9.78 8.9,9.69 9.64,9.69 9.73,9.6 9.73,8.96 9.82,8.87 10.14,8.87 10.23,8.96 10.23,9.6 10.32,9.69 10.61,9.69 10.82,9.89 10.94,9.89 11.21,9.62 11.34,9.62 11.57,9.85 11.57,9.98 11.3,10.25 11.3,10.37 12.51,11.59 12.51,11.91 12.46,11.97 12.46,12.08 U2.H3 ; 5.66,8.98 5.72,8.93
  Bottom Layer w0.127: v1(5.81,5.98) 5.81,7.28 5.72,7.36 5.65,7.36 5.56,7.45 5.56,7.78 5.65,7.86 5.72,7.86 5.81,7.95 5.81,8.32 5.59,8.55 v1(5.59,8.93)
$1N3209: length 0.5
  Top Layer w0.127: U2.H8 v1(15.52,15.66)
